# EAGLE design MAX3421E_feather_wing (EAGLE 7.6.0)
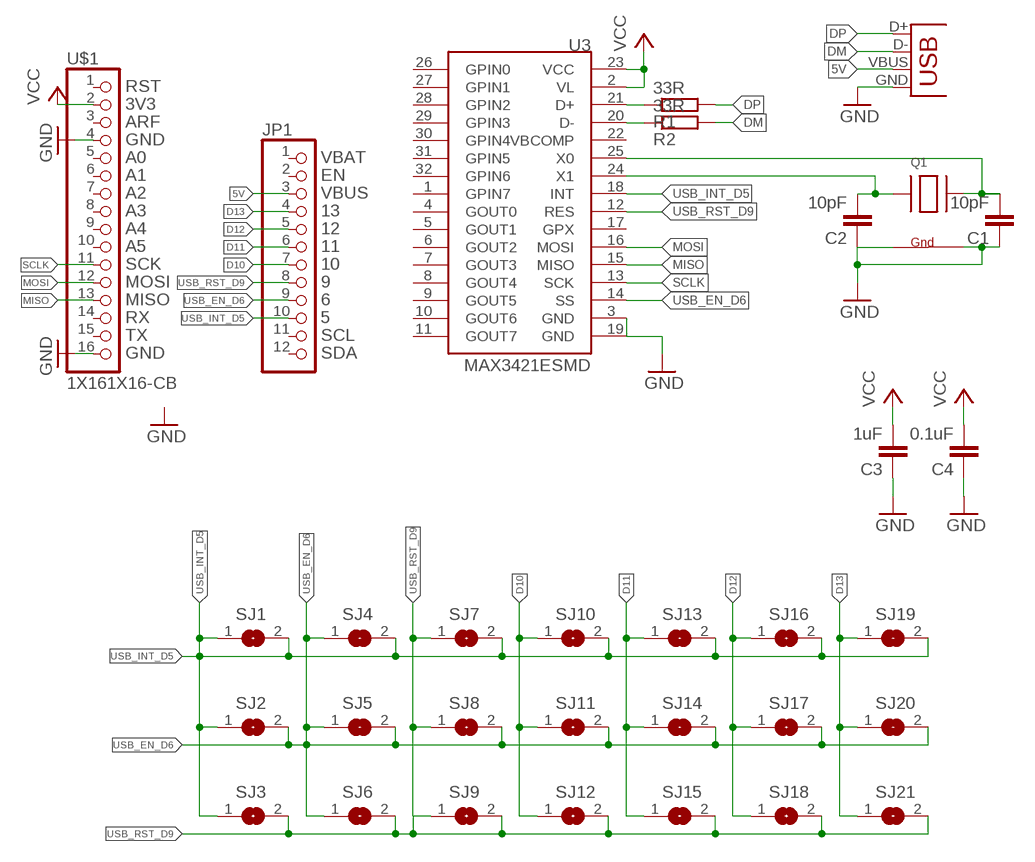
[diagram p0: schematic, sheet 1]

## Parts
C1  10pF  C-EUC0805K  [C0805K]
C2  10pF  C-EUC0805K  [C0805K]
C3  1uF  C-EUC0805K  [C0805K]
C4  0.1uF  C-EUC0805K  [C0805K]
JP1  PINHD-1X12-CB  [1X12-CB]
JP3  USBUSB-A-S-NOSILK  [USB-A-S-NOSILK]
Q1  XTAL-4-3225  [NX3225]
R1  33R  R-EU_R0805  [R0805]
R2  33R  R-EU_R0805  [R0805]
SJ1  SJ  [SJ]
SJ2  SJ  [SJ]
SJ3  SJ  [SJ]
SJ4  SJ  [SJ]
SJ5  SJ  [SJ]
SJ6  SJ  [SJ]
SJ7  SJ  [SJ]
SJ8  SJ  [SJ]
SJ9  SJ  [SJ]
SJ10  SJ  [SJ]
SJ11  SJ  [SJ]
SJ12  SJ  [SJ]
SJ13  SJ  [SJ]
SJ14  SJ  [SJ]
SJ15  SJ  [SJ]
SJ16  SJ  [SJ]
SJ17  SJ  [SJ]
SJ18  SJ  [SJ]
SJ19  SJ  [SJ]
SJ20  SJ  [SJ]
SJ21  SJ  [SJ]
U3  MAX3421ESMD  [TQFP32-5MM]
U$1  1X161X16-CB  [1X16-CB]

## Nets
5V: JP1.3 JP3.VBUS
D10: JP1.7 SJ10.1 SJ11.1 SJ12.1
D11: JP1.6 SJ13.1 SJ14.1 SJ15.1
D12: JP1.5 SJ16.1 SJ17.1 SJ18.1
D13: JP1.4 SJ19.1 SJ20.1 SJ21.1
DM: JP3.D- R2.2
DM_CR: R2.1 U3.20(D-)
DP: JP3.D+ R1.2
DP_CR: R1.1 U3.21(D+)
GND: C1.1 C2.1 C3.1 C4.1 JP3.GND Q1.2(G2) Q1.4(G1) U3.3(GND) U3.19(GND) U$1.4 U$1.16
MISO: U3.15(MISO) U$1.13
MOSI: U3.16(MOSI) U$1.12
SCLK: U3.13(SCK) U$1.11
USB_EN_D6: JP1.9 SJ2.2 SJ4.1 SJ5.1 SJ5.2 SJ6.1 SJ8.2 SJ11.2 SJ14.2 SJ17.2 SJ20.2 U3.14(SS)
USB_INT_D5: JP1.10 SJ1.1 SJ1.2 SJ2.1 SJ3.1 SJ4.2 SJ7.2 SJ10.2 SJ13.2 SJ16.2 SJ19.2 U3.18(INT)
USB_RST_D9: JP1.8 SJ3.2 SJ6.2 SJ7.1 SJ8.1 SJ9.1 SJ9.2 SJ12.2 SJ15.2 SJ18.2 SJ21.2 U3.12(RES)
VCC: C3.2 C4.2 U3.2(VL) U3.23(VCC) U$1.2
X0: C1.2 Q1.3(X2) U3.25(X0)
X1: C2.2 Q1.1(X1) U3.24(X1)
Unconnected: JP1.1 JP1.2 JP1.11 JP1.12 U3.1(GPIN7) U3.4(GOUT0) U3.5(GOUT1) U3.6(GOUT2) U3.7(GOUT3) U3.8(GOUT4) U3.9(GOUT5) U3.10(GOUT6) U3.11(GOUT7) U3.17(GPX) U3.22(VBCOMP) U3.26(GPIN0) U3.27(GPIN1) U3.28(GPIN2) U3.29(GPIN3) U3.30(GPIN4) U3.31(GPIN5) U3.32(GPIN6) U$1.1 U$1.3 U$1.5 U$1.6 U$1.7 U$1.8 U$1.9 U$1.10 U$1.14 U$1.15

## Notes on the sheet
- RST
- 3V3
- ARF
- GND
- A0 | VBAT
- A1 | EN
- A2 | VBUS
- A3 | 13
- A4 | 12
- A5 | 11
- SCK | 10
- MOSI | 9
- MISO | 6
- RX | 5
- TX | SCL
- GND | SDA

## Library data of the parts
C1-C4 = rcl:C-EU: CAPACITOR, European symbol
JP1 = adafruit:PINHD-1X12: PIN HEADER
JP3 = SparkFun-Connectors Kopie:USB: USB Connectors USB-B-PTH is fully proven SKU : PRT-00139/CONN-08278 USB-miniB is fully proven SKU : PRT-00587 USB-A-PCB is untested. USB-A-H is throughly reviewed, but untested. Spark Fun Electronics SKU : PRT-00437 USB-B-SMT is throughly reviewed, but untested. Needs silkscreen touching up. USB-A-S has not been used/tested USB-MB-H has not been used/tested USB-MICROB has been used. CONN-09505
Q1 = adafruit:XTAL-4: Classic 4-pin 3.2 x 2.5mm crystal
R1 R2 = rcl:R-EU_: RESISTOR, European symbol
SJ1-SJ21 = jumper:SJ: SMD solder JUMPER
U3 = SparkFun-DigitalIC:MAX3421E: USB Peripheral/Host Controller w/ SPI
U$1 = adafruit:1X16

## Board
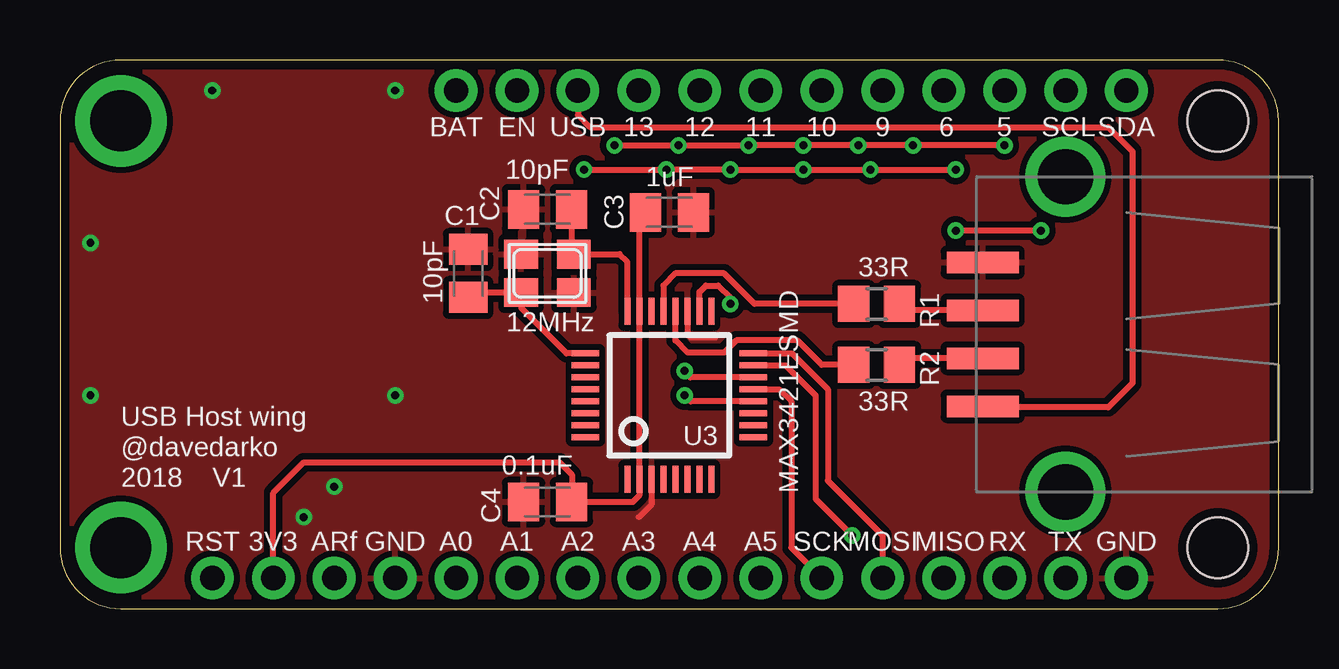
[diagram p1: board, top side]
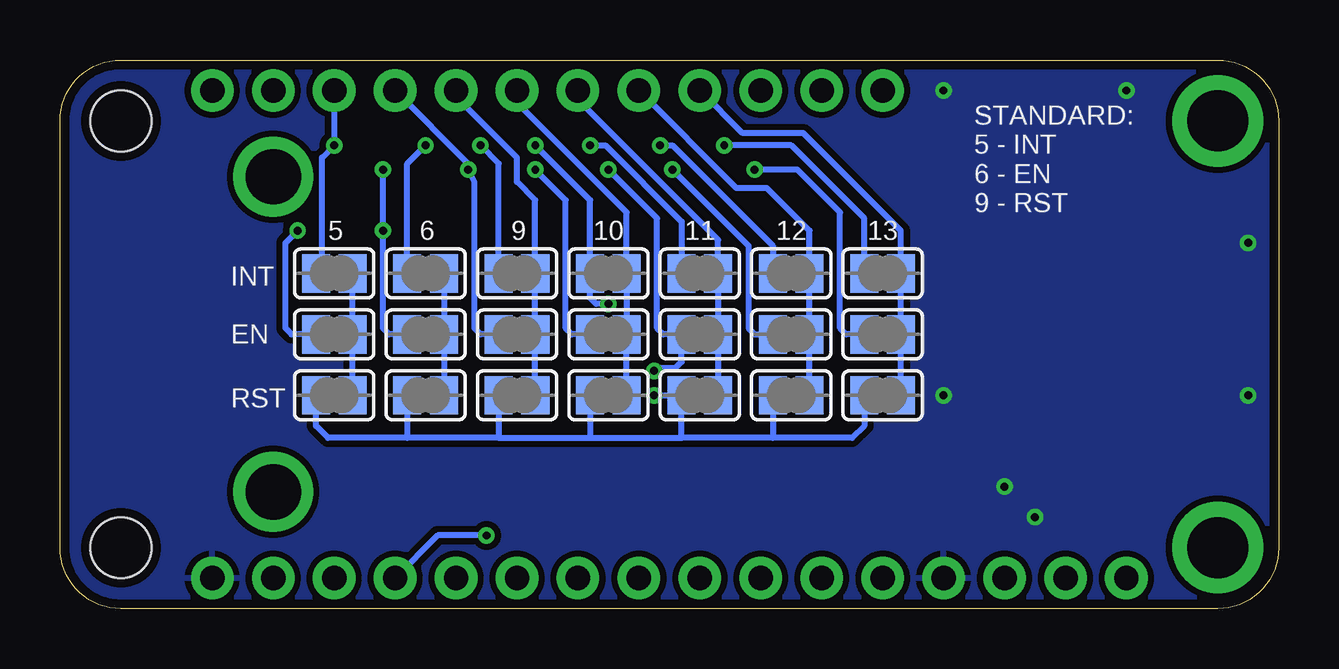
[diagram p2: board, bottom side, seen from below]

Size 50.8 x 22.86 mm. Coordinates in mm from the lower left corner, seen from the top.
Outline: 0,20.32 0,2.54 arc90 2.54,0 48.26,0 arc90 50.8,2.54 50.8,20.32 arc90 48.26,22.86 2.54,22.86 arc90 0,20.32
Copper layers (1*16): Top 0.0356mm / dielectric 1.5011mm / Bottom 0.0356mm
Design rules "LaenPCBOrder *": minimum track width 6mil, minimum drill 13mil, track to track 6mil, track to pad 6mil, pad to pad 6mil, via to via 6mil, smd to smd 6mil, copper to edge 15mil, drill to drill 6mil, minimum pad ring 7mil, minimum via ring 7mil, stop-mask expansion 3mil, vias tented up to drill 20mil, thermal gap 10mil
Holes 2.54 mm at 48.26,20.32 48.26,2.54

### Footprints (pad centres in the part's own frame; a part is rotated, then mirrored left to right if it is on the bottom)
C0805K = smd 1.3 x 1.6: 1 -1,0; 2 1,0
1X12-CB = drill 1.016 pad 1.778: 1 -13.97,0; 2 -11.43,0; 3 -8.89,0; 4 -6.35,0; 5 -3.81,0; 6 -1.27,0; 7 1.27,0; 8 3.81,0; 9 6.35,0; 10 8.89,0; 11 11.43,0; 12 13.97,0
USB-A-S-NOSILK = smd 3 x 0.9: D+ 3.45,-1; D- 3.45,1; GND 3.45,-3; VBUS 3.45,3 | drill 2.311: P$5 0,-6.566; P$6 0,6.566
NX3225 = smd 1.4 x 1.2: 1 -1.1,-0.8; 2 1.1,-0.8; 3 1.1,0.8; 4 -1.1,0.8
R0805 = smd 1.3 x 1.5: 1 -0.95,0; 2 0.95,0
SJ = smd 1.168 x 1.6: 1 -0.762,0; 2 0.762,0
TQFP32-5MM = smd 1.143 x 0.254: 1 -3.5,1.75; 2 -3.5,1.25; 3 -3.5,0.75; 4 -3.5,0.25; 5 -3.5,-0.25; 6 -3.5,-0.75; 7 -3.5,-1.25; 8 -3.5,-1.75; 17 3.5,-1.75; 18 3.5,-1.25; 19 3.5,-0.75; 20 3.5,-0.25; 21 3.5,0.25; 22 3.5,0.75; 23 3.5,1.25; 24 3.5,1.75 | smd 0.254 x 1.143: 9 -1.75,-3.5; 10 -1.25,-3.5; 11 -0.75,-3.5; 12 -0.25,-3.5; 13 0.25,-3.5; 14 0.75,-3.5; 15 1.25,-3.5; 16 1.75,-3.5; 25 1.75,3.5; 26 1.25,3.5; 27 0.75,3.5; 28 0.25,3.5; 29 -0.25,3.5; 30 -0.75,3.5; 31 -1.25,3.5; 32 -1.75,3.5
1X16-CB = drill 1.016 pad 1.778: 1 -19.05,0; 2 -16.51,0; 3 -13.97,0; 4 -11.43,0; 5 -8.89,0; 6 -6.35,0; 7 -3.81,0; 8 -1.27,0; 9 1.27,0; 10 3.81,0; 11 6.35,0; 12 8.89,0; 13 11.43,0; 14 13.97,0; 15 16.51,0; 16 19.05,0

### Placement (x,y rotation side)
C1  17.02,13.97 270 top
C2  20.32,16.64 0 top
C3  25.4,16.51 180 top
C4  20.32,4.45 0 top
JP1  30.48,21.59 0 top
JP3  41.91,11.43 180 top
Q1  20.32,13.97 180 top
R1  34.04,12.7 0 top
R2  34.04,10.16 0 top
SJ1  39.37,13.97 180 bottom
SJ2  39.37,11.43 180 bottom
SJ3  39.37,8.89 180 bottom
SJ4  35.56,13.97 180 bottom
SJ5  35.56,11.43 180 bottom
SJ6  35.56,8.89 180 bottom
SJ7  31.75,13.97 180 bottom
SJ8  31.75,11.43 180 bottom
SJ9  31.75,8.89 180 bottom
SJ10  27.94,13.97 180 bottom
SJ11  27.94,11.43 180 bottom
SJ12  27.94,8.89 180 bottom
SJ13  24.13,13.97 180 bottom
SJ14  24.13,11.43 180 bottom
SJ15  24.13,8.89 180 bottom
SJ16  20.32,13.97 180 bottom
SJ17  20.32,11.43 180 bottom
SJ18  20.32,8.89 180 bottom
SJ19  16.51,13.97 180 bottom
SJ20  16.51,11.43 180 bottom
SJ21  16.51,8.89 180 bottom
U3  25.4,8.89 90 top
U$1  25.4,1.27 0 top
U$2  [DAVEDARKO_GOLD]  7.62,11.43 0 top

### Tracks (layer width: path | path; a pad name or v marks a point on that pad's centre or on a via)
5V
  Top 0.254: JP1.3 21.59,20.57 22.1,20.07 43.69,20.07 44.7,19.05 44.7,9.4 43.69,8.38 38.51,8.38 JP3.VBUS
D10
  Bottom 0.254: SJ12.1 SJ11.1 SJ10.1 27.18,16.51 31.75,21.08 JP1.7
D11
  Bottom 0.254: SJ15.1 SJ14.1 SJ13.1 23.37,15.37 29.21,21.21 JP1.6
D12
  Bottom 0.254: SJ18.1 SJ17.1 SJ16.1 19.56,15.75 21.34,17.53 22.61,17.53 JP1.5
D13
  Bottom 0.254: SJ21.1 SJ20.1 SJ19.1 15.75,15.75 19.81,19.81 22.35,19.81 JP1.4
DM
  Top 0.254: JP3.D- 35.51,10.43 R2.2
DM_CR
  Top 0.254: R2.1 31.75,10.16 30.73,11.18 28.19,11.18 27.69,10.67 26.16,10.67 25.65,11.18 U3.20
DP
  Top 0.254: JP3.D+ 35.51,12.43 R1.2
DP_CR
  Top 0.254: R1.1 28.96,12.7 27.69,13.97 25.65,13.97 25.15,13.46 U3.21
GND  (via drill 0.33)
  Top 0.254: U3.19 26.15,11.44 26.29,11.3 27.3,11.3 27.43,11.43 | U3.3 24.65,4.33 24.13,3.81
  other vias: 13.97,8.89 1.27,8.89 1.27,15.24 10.16,3.81 11.43,5.08 6.35,21.59 13.97,21.59
  pour Bottom (isolate 0.254): -1.27,25.4 52.07,25.4 52.07,-2.54 -1.27,-2.54
  pour Top (isolate 0.254): -2.54,24.13 53.34,24.13 53.34,-1.27 -2.54,-1.27
MISO  (via drill 0.33)
  Top 0.254: U3.15 30.25,10.14 31.5,8.89 31.5,4.57 v33.02,3.05
  Bottom 0.254: v33.02,3.05 35.05,3.05 U$1.13
MOSI
  Top 0.254: U3.16 30.51,10.64 32,9.14 32,5.33 34.29,3.05 U$1.12
N$1  (via drill 2.54 pad 3.81)
  other vias: 2.54,20.32
N$3  (via drill 2.54 pad 3.81)
  other vias: 2.54,2.54
SCLK
  Top 0.254: U3.13 29.98,9.14 30.48,8.64 30.48,2.54 U$1.11
USB_EN_D6  (via drill 0.33)
  Top 0.254: v21.84,18.29 v25.27,18.29 v27.94,18.29 v30.99,18.29 v33.78,18.29 v37.34,18.29 | v40.89,15.75 v37.34,15.75 | U3.14 26.28,9.64 v26.04,9.91
  Bottom 0.254: SJ20.2 18.03,11.43 18.29,11.68 18.29,16.51 20.07,18.29 v21.84,18.29 | v25.27,18.29 22.1,15.11 22.1,11.68 21.84,11.43 SJ17.2 | v27.94,18.29 25.91,16.26 25.91,11.68 25.65,11.43 SJ14.2 24.89,10.29 25.15,10.03 25.78,10.03 v26.04,9.91 | SJ11.2 29.46,11.43 29.72,11.68 29.72,17.02 v30.99,18.29 | SJ8.2 33.27,11.43 33.53,11.68 33.53,17.78 v33.78,18.29 33.78,18.54 | v37.34,18.29 v37.34,15.75 37.34,11.68 37.08,11.43 SJ5.2 SJ5.1 | SJ2.2 41.15,11.43 41.4,11.68 41.4,15.24 v40.89,15.75 | SJ5.1 SJ6.1 | SJ4.1 SJ5.1 | 33.78,18.54 JP1.9 33.78,18.54
USB_INT_D5  (via drill 0.33)
  Top 0.254: v23.11,19.3 v25.78,19.3 v28.7,19.3 v30.99,19.3 v33.27,19.3 v35.56,19.3 v39.37,19.3 | U3.18 26.65,13.19 26.92,13.46 27.43,13.46 27.94,12.95 v27.94,12.7
  Bottom 0.254: SJ19.2 17.27,16.26 20.32,19.3 v23.11,19.3 | v25.78,19.3 25.27,19.3 21.08,15.11 SJ16.2 | v28.7,19.3 28.07,19.3 24.89,16.13 SJ13.2 | v30.99,19.3 28.7,17.02 SJ10.2 28.7,12.95 28.45,12.7 v27.94,12.7 | SJ7.2 32.51,18.54 v33.27,19.3 | SJ4.2 36.32,18.54 v35.56,19.3 | SJ3.1 SJ2.1 SJ1.1 SJ1.2 39.88,13.97 39.88,18.8 v39.37,19.3 JP1.10
USB_RST_D9  (via drill 0.33)
  Top 0.254: U3.12 26.29,8.64 v26.04,8.89
  Bottom 0.254: JP1.8 34.29,21.34 31.75,18.8 31.75,17.78 30.99,17.02 SJ7.1 SJ8.1 SJ9.1 SJ9.2 32.51,7.11 | SJ21.2 17.27,7.62 17.78,7.11 21.08,7.11 | 21.08,7.11 24.89,7.11 | 32.51,7.11 36.32,7.11 | 36.32,7.11 39.62,7.11 40.13,7.62 SJ3.2 | SJ6.2 36.32,7.11 | SJ18.2 21.08,7.11 | 32.51,7.11 28.7,7.11 | 28.7,7.11 24.89,7.11 | 24.89,7.11 SJ15.2 v26.04,8.89 | SJ12.2 28.7,7.11
VCC
  Top 0.254: C3.2 24.15,16.25 U3.23 U3.2 24.15,4.72 23.88,4.45 C4.2 21.34,4.46 21.34,5.59 20.83,6.1 10.16,6.1 8.89,4.83 U$1.2
X0
  Top 0.254: C1.2 16.71,13.17 Q1.3 19.22,12.53 21.11,10.64 U3.25
X1
  Top 0.254: C2.2 21.32,14.87 Q1.1 23.33,14.77 23.65,14.45 U3.24

### Text on the board
tNames: BAT | EN | USB | 13 | 12 | 11 | 10 | 9 | 6 | 5 | SCL | SDA | 12MHz | USB Host wing | @davedarko | 2018 | V1 | RST | 3V3 | ARf | GND | A0 | A1 | A2 | A3 | A4 | A5 | SCK | MOSI | MISO | RX | TX | GND
bNames: STANDARD: / 5 - INT / 6 - EN / 9 - RST | 13 | 12 | 11 | 10 | 9 | 6 | 5 | INT | EN | RST